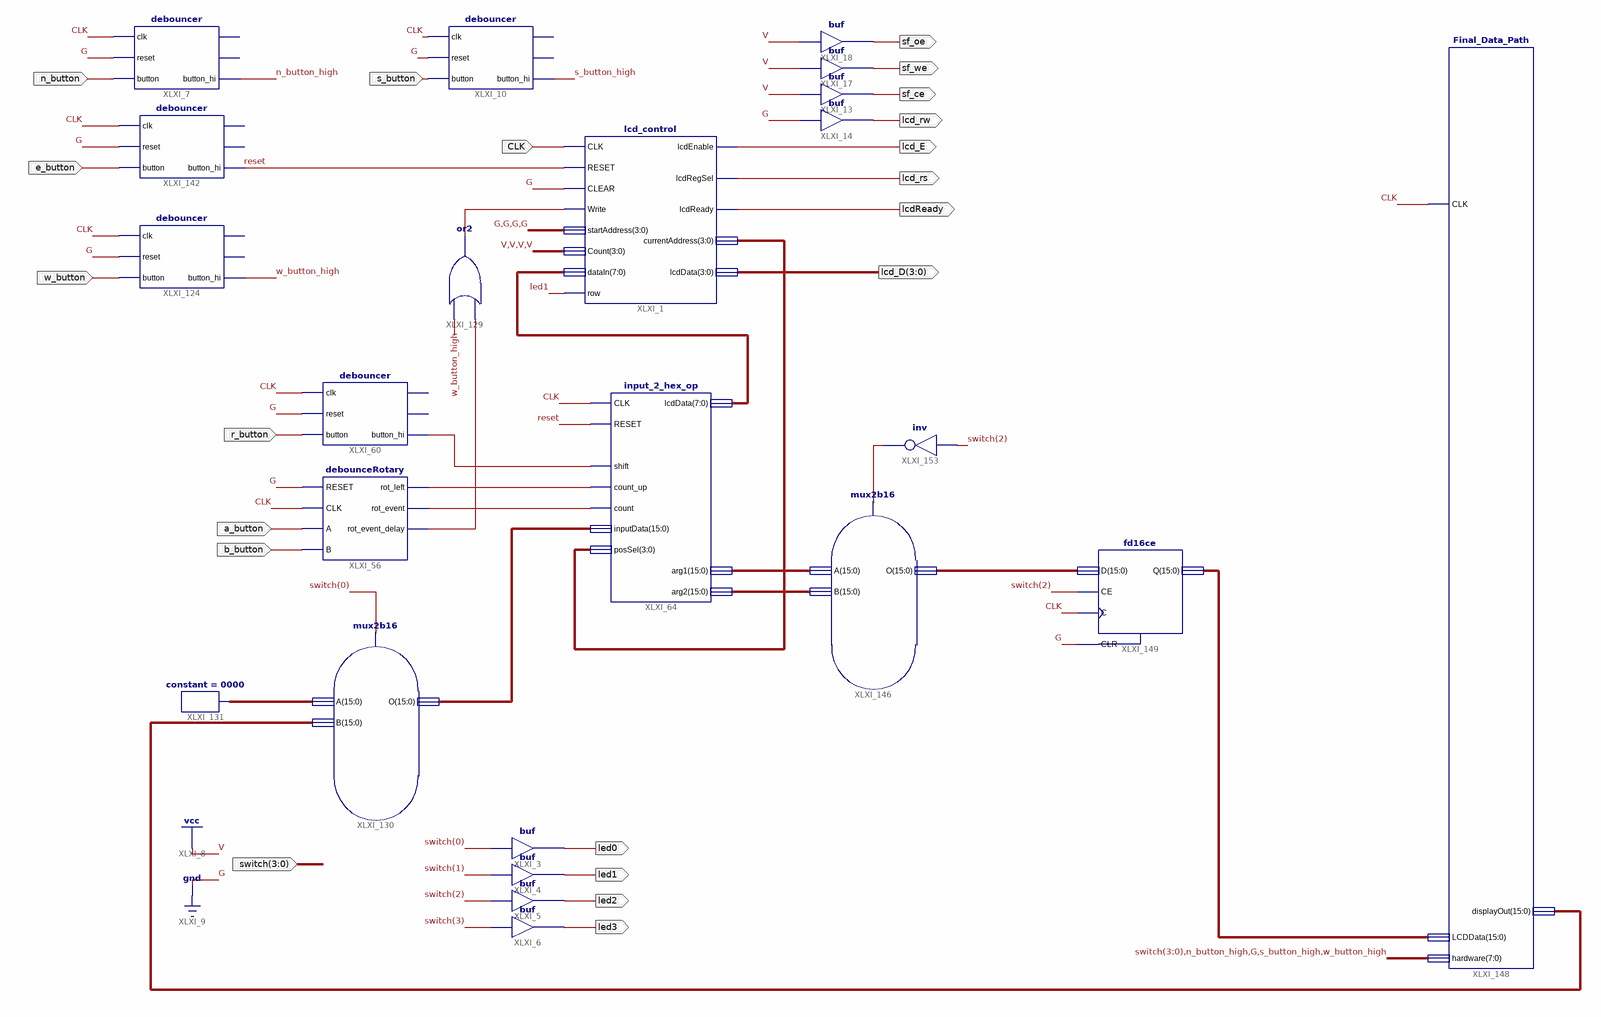
[diagram p0: schematic sheet 1]
// Xilinx ISE schematic aluIO.sch (spartan3e) as structural Verilog: 23 symbols, 21 ports
module aluIO (
  input  CLK,
  input  a_button,
  input  b_button,
  input  r_button,
  input  n_button,
  input  e_button,
  input  w_button,
  input  s_button,
  input  [3:0] switch,
  output lcdReady,
  output lcd_rs,
  output lcd_E,
  output sf_ce,
  output lcd_rw,
  output sf_we,
  output sf_oe,
  output led1,
  output [3:0] lcd_D,
  output led2,
  output led3,
  output led0
);

  wire n_button_high, reset, s_button_high, w_button_high, XLXN_116, XLXN_135, XLXN_136, XLXN_386, XLXN_478,
       XLXN_549;
  wire [3:0] XLXN_487;
  wire [7:0] XLXN_477;
  wire [15:0] XLXN_387, XLXN_388, XLXN_479, XLXN_520, XLXN_521, XLXN_542, XLXN_546;

  buf XLXI_13 (sf_ce, 1'b1);
  buf XLXI_14 (lcd_rw, 1'b0);
  buf XLXI_17 (sf_we, 1'b1);
  buf XLXI_18 (sf_oe, 1'b1);
  lcd_control XLXI_1 (
    .CLK(CLK), .RESET(reset), .CLEAR(1'b0), .Write(XLXN_478), .startAddress(4'b0000), .Count(4'b1111),
    .dataIn(XLXN_477), .lcdEnable(lcd_E), .lcdRegSel(lcd_rs), .lcdReady(lcdReady), .currentAddress(XLXN_487),
    .lcdData(lcd_D), .row(led1));
  input_2_hex_op XLXI_64 (
    .CLK(CLK), .RESET(reset), .shift(XLXN_386), .count(XLXN_136), .posSel(XLXN_487), .inputData(XLXN_520),
    .count_up(XLXN_135), .lcdData(XLXN_477), .arg1(XLXN_387), .arg2(XLXN_388));
  debounceRotary XLXI_56 (
    .A(a_button), .B(b_button), .CLK(CLK), .RESET(1'b0), .rot_event(XLXN_136), .rot_event_delay(XLXN_116),
    .rot_left(XLXN_135));
  debouncer XLXI_60 (.clk(CLK), .reset(1'b0), .button(r_button), .button_hi(XLXN_386));  // open: debutton, button_lo
  mux2b16 XLXI_130 (.A(XLXN_479), .B(XLXN_542), .O(XLXN_520), .S(switch[0]));
  debouncer XLXI_142 (.clk(CLK), .reset(1'b0), .button(e_button), .button_hi(reset));  // open: debutton, button_lo
  debouncer XLXI_7 (
    .clk(CLK), .reset(1'b0), .button(n_button), .button_hi(n_button_high));  // open: debutton, button_lo
  debouncer XLXI_124 (
    .clk(CLK), .reset(1'b0), .button(w_button), .button_hi(w_button_high));  // open: debutton, button_lo
  or XLXI_129 (XLXN_478, XLXN_116, w_button_high);
  debouncer XLXI_10 (
    .clk(CLK), .reset(1'b0), .button(s_button), .button_hi(s_button_high));  // open: debutton, button_lo
  mux2b16 XLXI_146 (.A(XLXN_387), .B(XLXN_388), .O(XLXN_521), .S(XLXN_549));
  Final_Data_Path XLXI_148 (
    .CLK(CLK), .LCDData(XLXN_546), .hardware({switch, n_button_high, 1'b0, s_button_high, w_button_high}),
    .displayOut(XLXN_542));
  constant #(.CValue("0000")) XLXI_131 (.O(XLXN_479));
  buf XLXI_3 (led0, switch[0]);
  buf XLXI_4 (led1, switch[1]);
  buf XLXI_5 (led2, switch[2]);
  buf XLXI_6 (led3, switch[3]);
  fd16ce XLXI_149 (.C(CLK), .CE(switch[2]), .CLR(1'b0), .D(XLXN_521), .Q(XLXN_546));
  not XLXI_153 (XLXN_549, switch[2]);
endmodule
